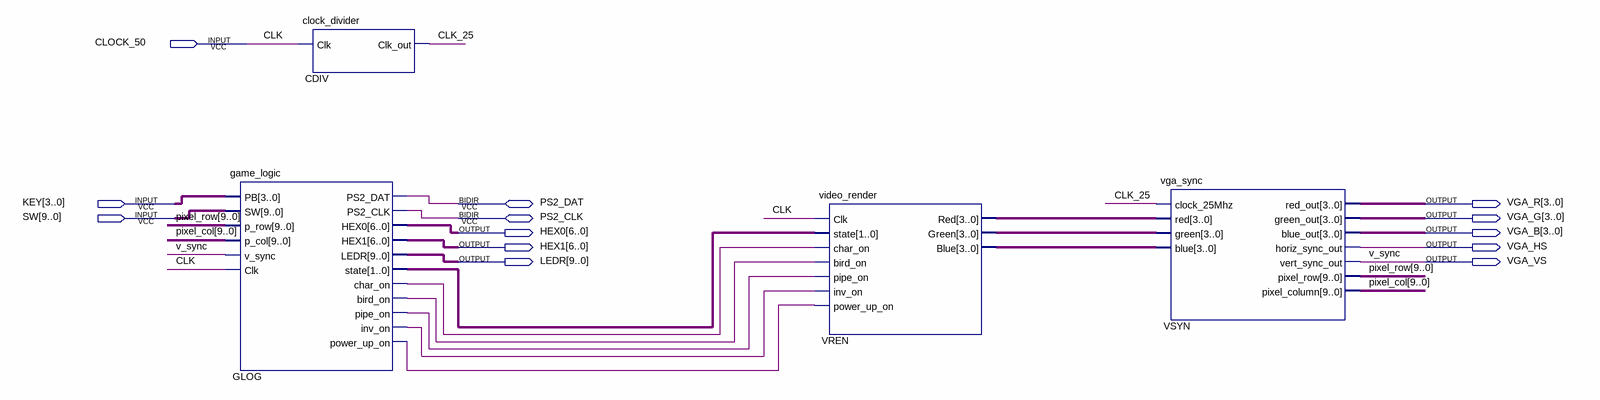
[diagram p0: schematic sheet]
// Quartus schematic Flappy_Bird.bdf as structural Verilog: 4 symbols, 13 pins
module Flappy_Bird (
  input  CLOCK_50,
  input  [3:0] KEY,
  input  [9:0] SW,
  inout  PS2_DAT,
  inout  PS2_CLK,
  output [3:0] VGA_R,
  output [3:0] VGA_G,
  output [6:0] HEX0,
  output [3:0] VGA_B,
  output [6:0] HEX1,
  output VGA_HS,
  output [9:0] LEDR,
  output VGA_VS
);

  wire CLK_25, GLOG_bird_on, GLOG_char_on, GLOG_inv_on, GLOG_pipe_on, GLOG_power_up_on;
  wire [1:0] GLOG_state;
  wire [3:0] VREN_blue, VREN_green, VREN_red;
  wire [9:0] pixel_col, pixel_row;

  game_logic GLOG (
    .PB(KEY), .SW(SW), .p_row(pixel_row), .p_col(pixel_col), .v_sync(VGA_VS), .Clk(CLOCK_50), .HEX0(HEX0),
    .HEX1(HEX1), .LEDR(LEDR), .state(GLOG_state), .char_on(GLOG_char_on), .bird_on(GLOG_bird_on),
    .pipe_on(GLOG_pipe_on), .inv_on(GLOG_inv_on), .power_up_on(GLOG_power_up_on), .PS2_DAT(PS2_DAT),
    .PS2_CLK(PS2_CLK));
  clock_divider CDIV (.Clk(CLOCK_50), .Clk_out(CLK_25));
  video_render VREN (
    .Clk(CLOCK_50), .state(GLOG_state), .char_on(GLOG_char_on), .bird_on(GLOG_bird_on),
    .pipe_on(GLOG_pipe_on), .inv_on(GLOG_inv_on), .power_up_on(GLOG_power_up_on), .Red(VREN_red),
    .Green(VREN_green), .Blue(VREN_blue));
  vga_sync VSYN (
    .clock_25Mhz(CLK_25), .red(VREN_red), .green(VREN_green), .blue(VREN_blue), .red_out(VGA_R),
    .green_out(VGA_G), .blue_out(VGA_B), .horiz_sync_out(VGA_HS), .vert_sync_out(VGA_VS),
    .pixel_row(pixel_row), .pixel_column(pixel_col));

  // Other names for the same wires on the sheet: CLK = CLOCK_50; v_sync = VGA_VS
endmodule
